# Altium project Power_PCB.PrjPcb
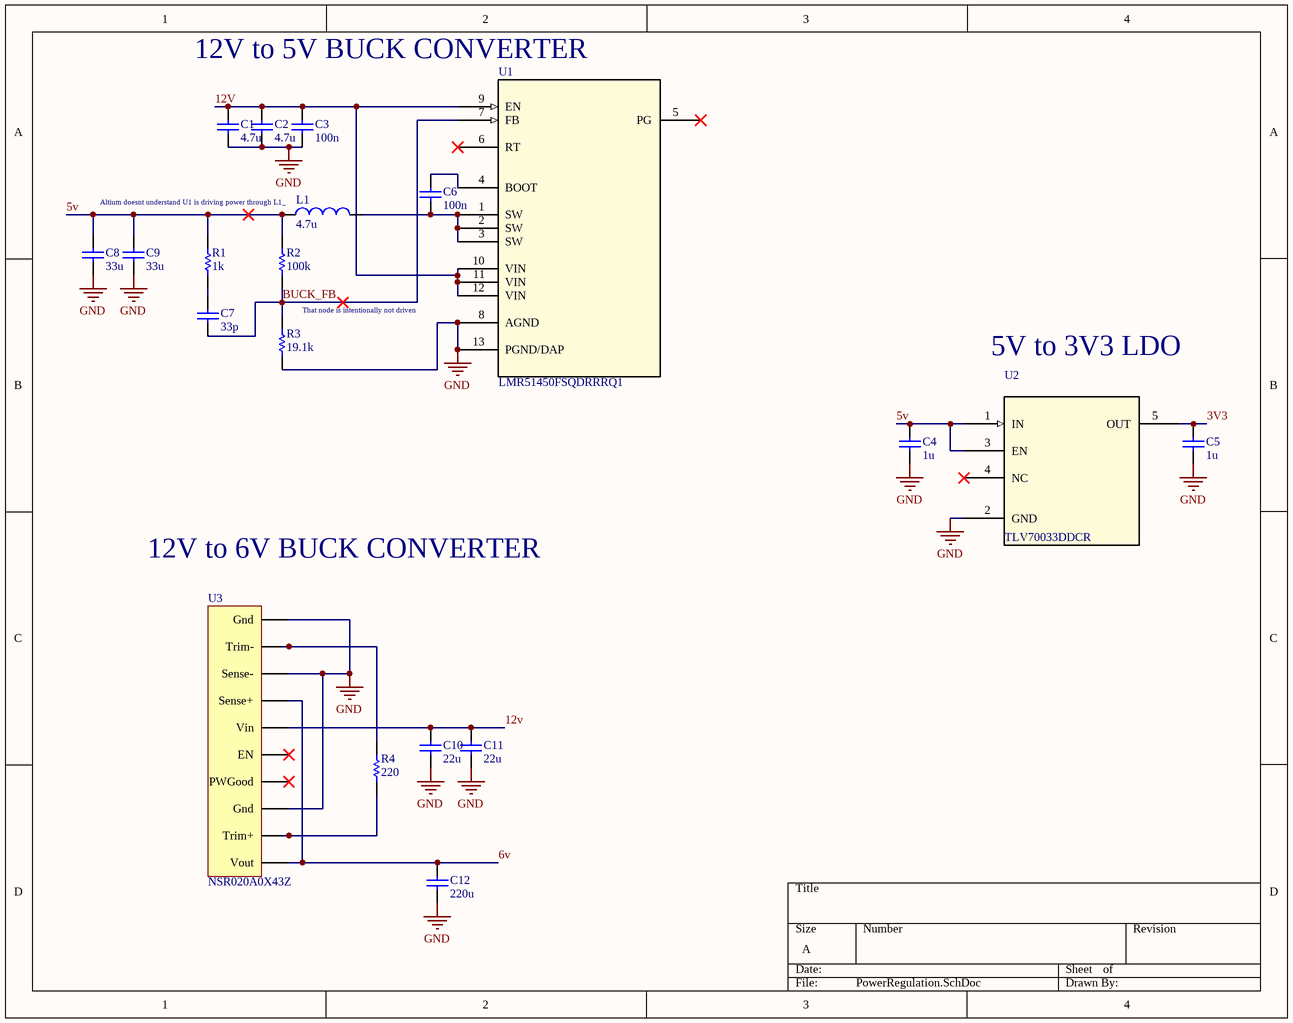
[diagram p0: PowerRegulation.SchDoc]
3 sheets, 59 parts. Net scope: global (net labels, ports and power ports of the same name join across sheets).
Board file: PCB1.PcbDoc
Sheets:
  PowerRegulation.SchDoc
  Connectors.SchDoc
  MCU.SchDoc

## Sheet PowerRegulation.SchDoc: Power Regulation
size A; Author: Bryton King; DrawnBy: Bryton King; Revision: 1; SheetNumber: 1; SheetTotal: 3

### Parts
C1  value 4.7u  [4.7u]  (hidden comment: Capacitor)
C2  value 4.7u  [4.7u]  (hidden comment: Capacitor)
C3  value 100n  [.1U]  (hidden comment: Capacitor)
C4  value 1u  [1U]  (hidden comment: Capacitor)
C5  value 1u  [1U]  (hidden comment: Capacitor)
C6  value 100n  [.1U]  (hidden comment: Capacitor)
C7  value 33p  [Cap33u]  (hidden comment: Capacitor)
C8  value 33u  [Cap33u]  (hidden comment: Capacitor)
C9  value 33u  [Cap33u]  (hidden comment: Capacitor)
C10  value 22u  [22u]  (hidden comment: Capacitor)
C11  value 22u  [22u]  (hidden comment: Capacitor)
C12  value 220u  [4.7u]  (hidden comment: Capacitor)
L1  value 4.7u  [4.7uIND]  (hidden comment: Inductor)
R1  value 1k  [resistor]  (hidden comment: Resistor)
R2  value 100k  [resistor]  (hidden comment: Resistor)
R3  value 19.1k  [resistor]  (hidden comment: Resistor)
R4  value 220  [resistor]  (hidden comment: Resistor)
U1  LMR51450FSQDRRRQ1  [LMR51450FSQDRRRQ1]
U2  TLV70033DDCR  [TLV70033DDCR]
U3  NSR020A0X43Z  [NSR020A0X43Z]

### Nets
GND: C1.1 C2.1 C3.1 C4.1 C5.1 C8.2 C9.2 C10.1 C11.1 C12.1 R3.1 U1.8(AGND) U1.13(PGND/DAP) U2.2(GND) U3.3(Gnd) U3.8(Sense-) U3.10(Gnd)
3V3: C5.2 U2.5(OUT)
5v: C4.2 C8.1 C9.1 L1.1 R1.2 R2.2 U2.1(IN) U2.3(EN)
6v: C12.2 U3.1(Vout) U3.7(Sense+)
12v: C1.2 C2.2 C3.2 C10.2 C11.2 U1.9(EN) U1.10(VIN) U1.11(VIN) U1.12(VIN) U3.6(Vin)
BUCK_FB: C7.2 R2.1 R3.2 U1.7(FB)
NetC6_1: C6.1 L1.2 U1.1(SW) U1.2(SW) U1.3(SW)
NetC6_2: C6.2 U1.4(BOOT)
NetC7_1: C7.1 R1.1
NetR4_1: R4.1 U3.2(Trim+)
NetR4_2: R4.2 U3.9(Trim-)

Not connected (* = marked no-connect by the designer): U1 5(PG)* 6(RT)*; U2 4(NC)*; U3 4(PWGood)* 5(EN)*

### Notes on the sheet
- 12V to 5V BUCK CONVERTER
- (near L1) Altium doesnt understand U1 is driving power through L1_
- That node is intentionally not driven
- 5V to 3V3 LDO
- 12V to 6V BUCK CONVERTER

### Library data of the parts
C1-C12 = Capacitor: SimulationGenericComponent: True
L1 = Inductor: SimulationGenericComponent: True
R1-R4 = Resistor: TC1: 0; SimulationGenericComponent: True; TC2: 0

## Sheet Connectors.SchDoc
size A; SheetNumber: 2; SheetTotal: 3
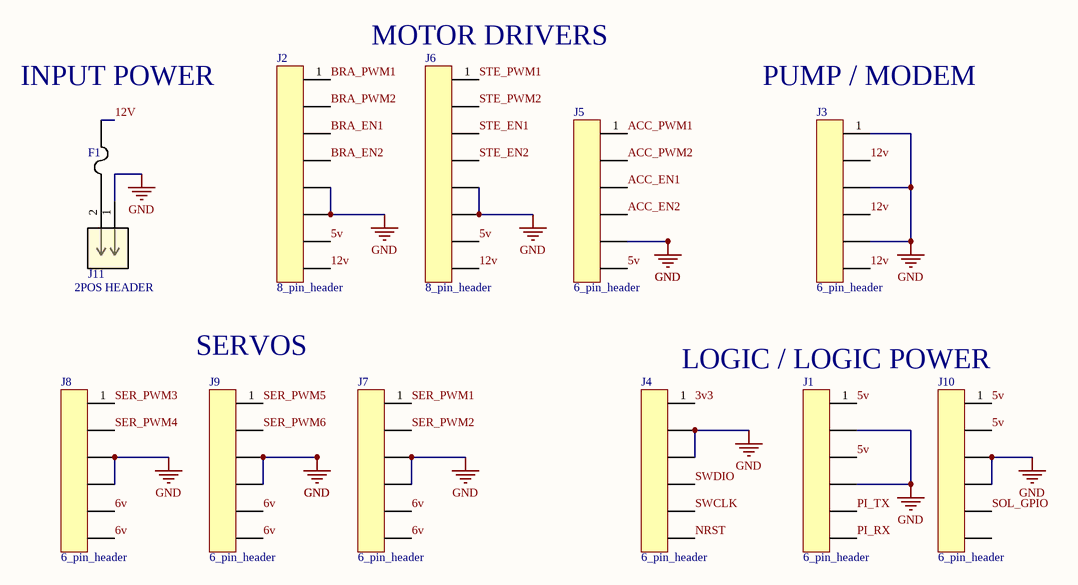
[diagram p1: Connectors.SchDoc]

### Parts
F1  FUSE_178.6764.0001_LTF  [fuse_holder]  (value not drawn)
J1  6_pin_header  [6pinHeader1]
J2  8_pin_header  [8pinHeader]
J3  6_pin_header  [6pinHeader2]
J4  6_pin_header  [6pinHeader1]
J5  6_pin_header  [6pinHeader1]
J6  8_pin_header  [8pinHeader]
J7  6_pin_header  [6pinHeader1]
J8  6_pin_header  [6pinHeader1]
J9  6_pin_header  [6pinHeader1]
J10  6_pin_header  [6pinHeader1]
J11  2POS HEADER  [CONN HEADER VERT 2POS]

### Nets
GND: J1.2 J1.4 J2.5 J2.6 J3.1 J3.3 J3.5 J4.2 J4.3 J5.5 J6.5 J6.6 J7.3 J7.4 J8.3 J8.4 J9.3 J9.4 J10.3 J10.4 J11.1
3V3: J4.1
5v: J1.1 J1.3 J2.7 J5.6 J6.7 J10.1 J10.2
6v: J7.5 J7.6 J8.5 J8.6 J9.5 J9.6
12v: F1.2 J2.8 J3.2 J3.4 J3.6 J6.8
ACC_EN1: J5.3
ACC_EN2: J5.4
ACC_PWM1: J5.1
ACC_PWM2: J5.2
BRA_EN1: J2.3
BRA_EN2: J2.4
BRA_PWM1: J2.1
BRA_PWM2: J2.2
NRST: J4.6
PI_RX: J1.6
PI_TX: J1.5
SER_PWM1: J7.1
SER_PWM2: J7.2
SER_PWM3: J8.1
SER_PWM4: J8.2
SER_PWM5: J9.1
SER_PWM6: J9.2
SOL_GPIO: J10.5
STE_EN1: J6.3
STE_EN2: J6.4
STE_PWM1: J6.1
STE_PWM2: J6.2
SWCLK: J4.5
SWDIO: J4.4
NetF1_1: F1.1 J11.2

Not connected (* = marked no-connect by the designer): J10 6

### Notes on the sheet
- INPUT POWER
- (near J6) MOTOR DRIVERS
- (near J3) PUMP / MODEM
- (near J9) SERVOS
- LOGIC / LOGIC POWER

### Library data of the parts
J1 = 6_pin_header: Pi
J2 = 8_pin_header: Brake Motor
J3 = 6_pin_header: Solenoid/Pump/Modem
J4 = 6_pin_header: Onboard Stm
J5 = 6_pin_header: Accel Motor
J6 = 8_pin_header: Steering Motor
J7 = 6_pin_header: Servo1&2
J8 = 6_pin_header: Servo3&4
J9 = 6_pin_header: Servo5&6
J10 = 6_pin_header: OffboardSTM & SolenoidGPIO
J11 = CONN HEADER VERT 2POS: 12V INPUT

## Sheet MCU.SchDoc
size A; SheetNumber: 3; SheetTotal: 3
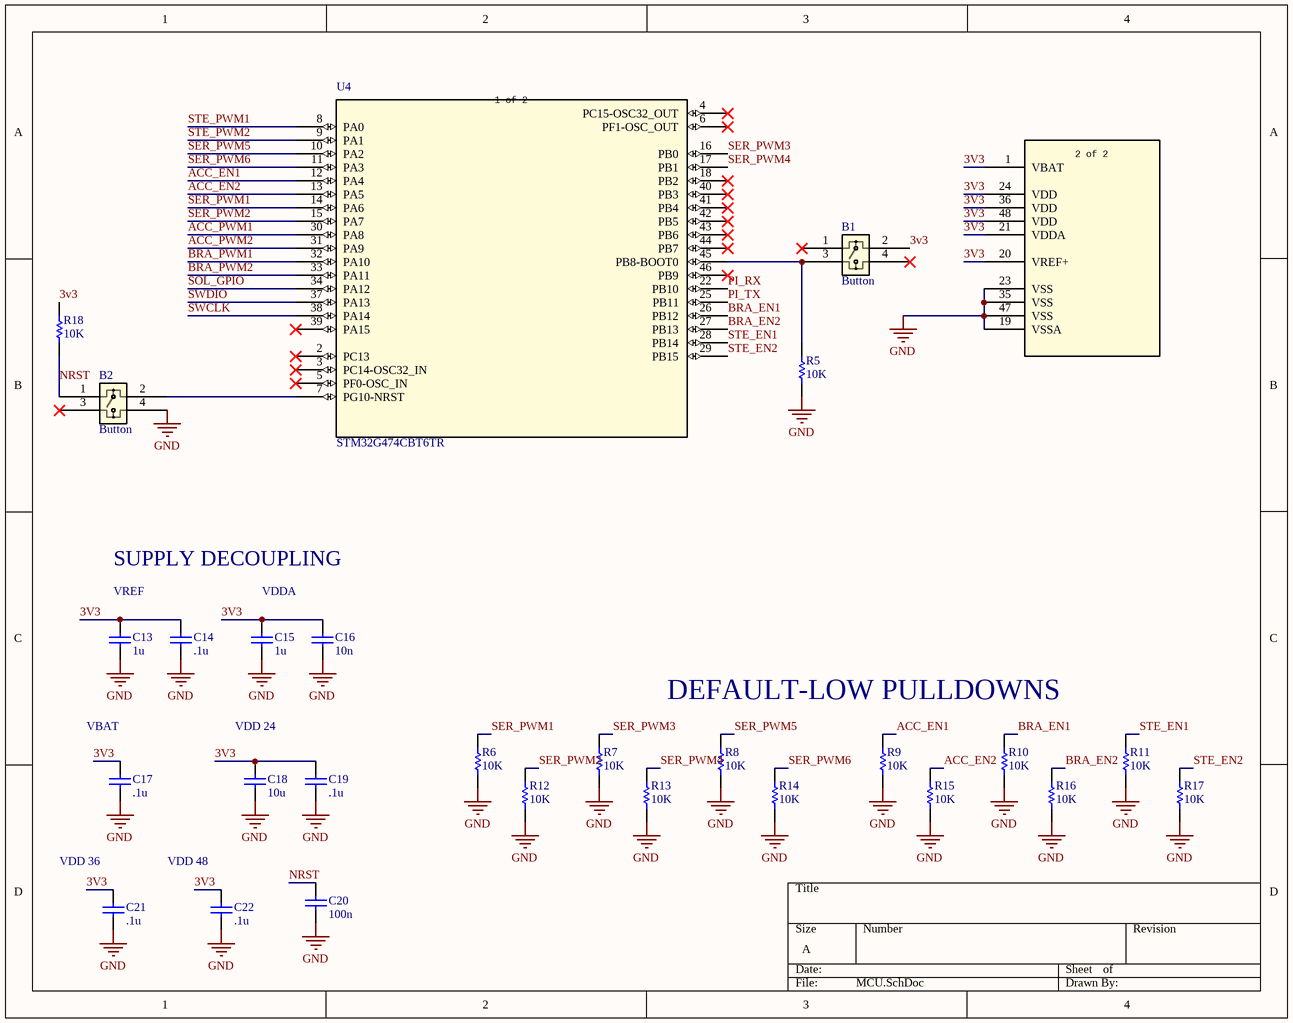
[diagram p2: MCU.SchDoc]

### Parts
B1  Button  [Button]
B2  Button  [Button]
C13  value 1u  [1U]  (hidden comment: Capacitor)
C14  value .1u  [1U]  (hidden comment: Capacitor)
C15  value 1u  [1U]  (hidden comment: Capacitor)
C16  value 10n  [1U]  (hidden comment: Capacitor)
C17  value .1u  [1U]  (hidden comment: Capacitor)
C18  value 10u  [1U]  (hidden comment: Capacitor)
C19  value .1u  [1U]  (hidden comment: Capacitor)
C20  value 100n  [1U]  (hidden comment: Capacitor)
C21  value .1u  [1U]  (hidden comment: Capacitor)
C22  value .1u  [1U]  (hidden comment: Capacitor)
R5  value 10K  [resistor]  (hidden comment: Resistor)
R6  value 10K  [resistor]  (hidden comment: Resistor)
R7  value 10K  [resistor]  (hidden comment: Resistor)
R8  value 10K  [resistor]  (hidden comment: Resistor)
R9  value 10K  [resistor]  (hidden comment: Resistor)
R10  value 10K  [resistor]  (hidden comment: Resistor)
R11  value 10K  [resistor]  (hidden comment: Resistor)
R12  value 10K  [resistor]  (hidden comment: Resistor)
R13  value 10K  [resistor]  (hidden comment: Resistor)
R14  value 10K  [resistor]  (hidden comment: Resistor)
R15  value 10K  [resistor]  (hidden comment: Resistor)
R16  value 10K  [resistor]  (hidden comment: Resistor)
R17  value 10K  [resistor]  (hidden comment: Resistor)
R18  value 10K  [resistor]  (hidden comment: Resistor)
U4  STM32G474CBT6TR  [STM32G474CBT6TR]

### Nets
GND: B2.4 C13.2 C14.2 C15.2 C16.2 C17.2 C18.2 C19.2 C20.2 C21.2 C22.2 R5.1 R6.1 R7.1 R8.1 R9.1 R10.1 R11.1 R12.1 R13.1 R14.1 R15.1 R16.1 R17.1 U4.19(VSSA) U4.23(VSS) U4.35(VSS) U4.47(VSS)
3V3: B1.2 C13.1 C14.1 C15.1 C16.1 C17.1 C18.1 C19.1 C21.1 C22.1 R18.2 U4.1(VBAT) U4.20(VREF+) U4.21(VDDA) U4.24(VDD) U4.36(VDD) U4.48(VDD)
ACC_EN1: R9.2 U4.12(PA4)
ACC_EN2: R15.2 U4.13(PA5)
ACC_PWM1: U4.30(PA8)
ACC_PWM2: U4.31(PA9)
BRA_EN1: R10.2 U4.26(PB12)
BRA_EN2: R16.2 U4.27(PB13)
BRA_PWM1: U4.32(PA10)
BRA_PWM2: U4.33(PA11)
NRST: B2.1 C20.1 R18.1
PI_RX: U4.22(PB10)
PI_TX: U4.25(PB11)
SER_PWM1: R6.2 U4.14(PA6)
SER_PWM2: R12.2 U4.15(PA7)
SER_PWM3: R7.2 U4.16(PB0)
SER_PWM4: R13.2 U4.17(PB1)
SER_PWM5: R8.2 U4.10(PA2)
SER_PWM6: R14.2 U4.11(PA3)
SOL_GPIO: U4.34(PA12)
STE_EN1: R11.2 U4.28(PB14)
STE_EN2: R17.2 U4.29(PB15)
STE_PWM1: U4.8(PA0)
STE_PWM2: U4.9(PA1)
SWCLK: U4.38(PA14)
SWDIO: U4.37(PA13)
NetB1_3: B1.3 R5.2 U4.45(PB8-BOOT0)
NetB2_2: B2.2 U4.7(PG10-NRST)

Not connected (* = marked no-connect by the designer): B1 1* 4*; B2 3*; U4 2(PC13)* 3(PC14-OSC32_IN)* 4(PC15-OSC32_OUT)* 5(PF0-OSC_IN)* 6(PF1-OSC_OUT)* 18(PB2)* 39(PA15)* 40(PB3)* 41(PB4)* 42(PB5)* 43(PB6)* 44(PB7)* 46(PB9)*

### Notes on the sheet
- SUPPLY DECOUPLING
- (near C13) VREF
- VDDA
- DEFAULT-LOW PULLDOWNS
- (near C17) VBAT
- VDD 24
- (near C21) VDD 36
- (near C22) VDD 48
- (in symbol STM32G474CBT6TR) 1 of 2; 2 of 2

### Library data of the parts
C13 = Capacitor: U4 VREF decoupling 2; SimulationGenericComponent: True
C14 = Capacitor: U4 VREF decoupling 1; SimulationGenericComponent: True
C15 = Capacitor: U4 VDDA decoupling 2; SimulationGenericComponent: True
C16 = Capacitor: U4 VDDA decoupling 1; SimulationGenericComponent: True
C17 = Capacitor: U4 VBAT decoupling; SimulationGenericComponent: True
C18 = Capacitor: Local 3.3 V bulk capacitor; SimulationGenericComponent: True
C19 = Capacitor: U4 VDD pin 24 decoupling; SimulationGenericComponent: True
C20 = Capacitor: SimulationGenericComponent: True
C21 = Capacitor: U4 VDD pin 36 decoupling; SimulationGenericComponent: True
C22 = Capacitor: U4 VDD pin 48 decoupling; SimulationGenericComponent: True
R5-R18 = Resistor: TC1: 0; SimulationGenericComponent: True; TC2: 0

## Nets that join several sheets
GND: PowerRegulation (17 pins), Connectors (21 pins), MCU (28 pins)
3V3: PowerRegulation (C5.2 U2.5), Connectors (J4.1), MCU (17 pins)
5v: PowerRegulation (8 pins), Connectors (7 pins)
6v: PowerRegulation (C12.2 U3.1 U3.7), Connectors (6 pins)
12v: PowerRegulation (10 pins), Connectors (6 pins)
ACC_EN1: Connectors (J5.3), MCU (R9.2 U4.12)
ACC_EN2: Connectors (J5.4), MCU (R15.2 U4.13)
ACC_PWM1: Connectors (J5.1), MCU (U4.30)
ACC_PWM2: Connectors (J5.2), MCU (U4.31)
BRA_EN1: Connectors (J2.3), MCU (R10.2 U4.26)
BRA_EN2: Connectors (J2.4), MCU (R16.2 U4.27)
BRA_PWM1: Connectors (J2.1), MCU (U4.32)
BRA_PWM2: Connectors (J2.2), MCU (U4.33)
NRST: Connectors (J4.6), MCU (B2.1 C20.1 R18.1)
PI_RX: Connectors (J1.6), MCU (U4.22)
PI_TX: Connectors (J1.5), MCU (U4.25)
SER_PWM1: Connectors (J7.1), MCU (R6.2 U4.14)
SER_PWM2: Connectors (J7.2), MCU (R12.2 U4.15)
SER_PWM3: Connectors (J8.1), MCU (R7.2 U4.16)
SER_PWM4: Connectors (J8.2), MCU (R13.2 U4.17)
SER_PWM5: Connectors (J9.1), MCU (R8.2 U4.10)
SER_PWM6: Connectors (J9.2), MCU (R14.2 U4.11)
SOL_GPIO: Connectors (J10.5), MCU (U4.34)
STE_EN1: Connectors (J6.3), MCU (R11.2 U4.28)
STE_EN2: Connectors (J6.4), MCU (R17.2 U4.29)
STE_PWM1: Connectors (J6.1), MCU (U4.8)
STE_PWM2: Connectors (J6.2), MCU (U4.9)
SWCLK: Connectors (J4.5), MCU (U4.38)
SWDIO: Connectors (J4.4), MCU (U4.37)